# EAGLE design CAN_node (EAGLE 6.2)
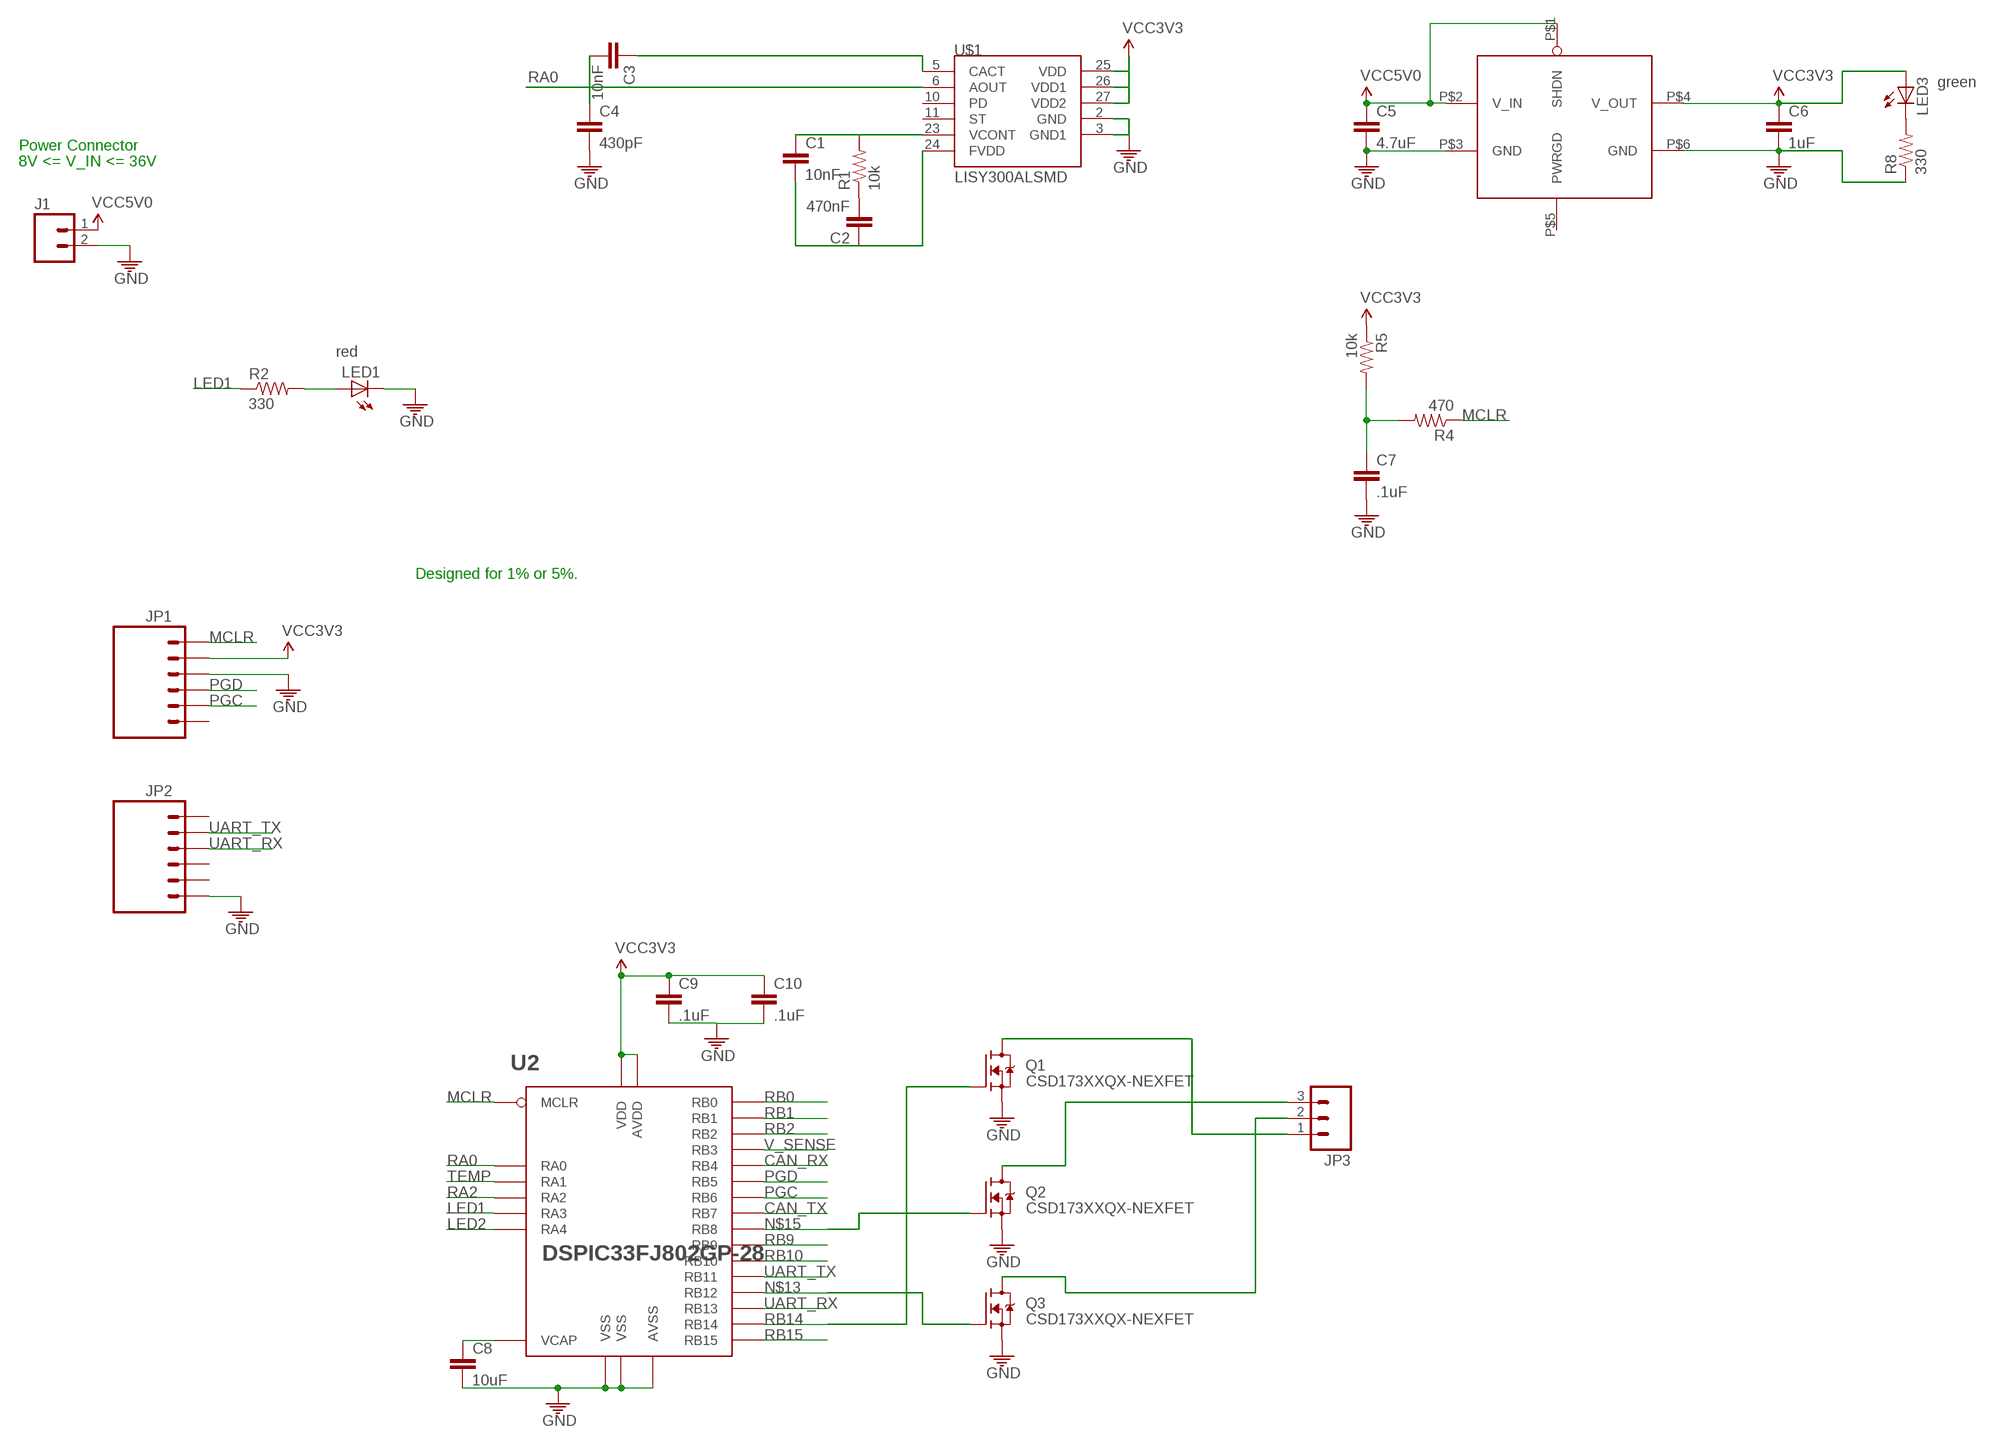
[diagram p0: schematic, sheet 1]

## Parts
C1  10nF  CAP1206  [1206]
C2  470nF  CAP1206  [1206]
C3  10nF  CAP1206  [1206]
C4  430pF  CAP1206  [1206]
C5  4.7uF  CAP1206  [1206]
C6  1uF  CAP1206  [1206]
C7  .1uF  CAP1206  [1206]
C8  10uF  CAP1206  [1206]
C9  .1uF  CAP1206  [1206]
C10  .1uF  CAP1206  [1206]
J1  M02PTH  [1X02]
JP1  M06LOCK  [1X06_LOCK]
JP2  M06LOCK  [1X06_LOCK]
JP3  M03PTH  [1X03]
LED1  LED1206  [LED-1206]
LED3  LED1206  [LED-1206]
Q1  CSD173XXQX-NEXFET  [CSD173XXQX]
Q2  CSD173XXQX-NEXFET  [CSD173XXQX]
Q3  CSD173XXQX-NEXFET  [CSD173XXQX]
R1  10k  RESISTOR0805-RES  [0805]
R2  330  RESISTOR0805-RES  [0805]
R4  470  RESISTOR0805-RES  [0805]
R5  10k  RESISTOR0805-RES  [0805]
R8  330  RESISTOR0805-RES  [0805]
U2  DSPIC33FJ802GP-28  [SOIC28-W]
U3  MCP1826  [SOT223-5]
U$1  LISY300ALSMD  [LGA28]

## Nets
CAN_RX: U2.P$11(RB4)
CAN_TX: U2.P$16(RB7)
GND [power]: C4.2 C5.2 C6.2 C7.2 C8.2 C9.2 C10.2 J1.2 JP1.3 JP2.6 LED1.C Q1.S1(S) Q1.S2(S) Q1.S3(S) Q2.S1(S) Q2.S2(S) Q2.S3(S) Q3.S1(S) Q3.S2(S) Q3.S3(S) R8.1 U2.P$8(VSS) U2.P$19(VSS) U2.P$27(AVSS) U3.P$3(GND) U3.P$6(GND) U$1.2(GND) U$1.3(GND1)
LED1: R2.1 U2.P$10(RA3)
LED2: U2.P$12(RA4)
MCLR: JP1.1 R4.1 U2.P$1(MCLR)
N$1: LED1.A R2.2
N$2: C2.2 R1.1
N$3: JP3.2 Q3.D
N$4: JP3.1 Q1.D
N$5: C1.1 R1.2 U$1.23(VCONT)
N$6: C7.1 R4.2 R5.2
N$7: C8.1 U2.P$20(VCAP)
N$8: LED3.C R8.2
N$9: JP3.3 Q2.D
N$10: C1.2 C2.1 U$1.24(FVDD)
N$12: C3.1 U$1.5(CACT)
N$13: Q3.G U2.P$23(RB12)
N$15: Q2.G U2.P$17(RB8)
PGC: JP1.5 U2.P$15(RB6)
PGD [small]: JP1.4 U2.P$14(RB5)
RA0: C3.2 C4.1 U2.P$2(RA0) U$1.6(AOUT)
RA2 [small]: U2.P$9(RA2)
RB0 [small]: U2.P$4(RB0)
RB1: U2.P$5(RB1)
RB2 [small]: U2.P$6(RB2)
RB9: U2.P$18(RB9)
RB10 [small]: U2.P$22(RB10)
RB14 [small]: Q1.G U2.P$25(RB14)
RB15 [small]: U2.P$26(RB15)
TEMP: U2.P$3(RA1)
UART_RX: JP2.3 U2.P$24(RB13)
UART_TX: JP2.2 U2.P$21(RB11)
V_SENSE: U2.P$7(RB3)
VCC3V3 [power]: C6.1 C9.1 C10.1 JP1.2 LED3.A R5.1 U2.P$13(VDD) U2.P$28(AVDD) U3.P$4(V_OUT) U$1.25(VDD) U$1.26(VDD1) U$1.27(VDD2)
VCC5V0 [power]: C5.1 J1.1 U3.P$1(SHDN) U3.P$2(V_IN)
Unconnected: JP1.6 JP2.1 JP2.4 JP2.5 U3.P$5(PWRGD) U$1.10(PD) U$1.11(ST)

## Notes on the sheet
- Power Connector
- 8V <= V_IN <= 36V
- Designed for 1% or 5%.

## Library data of the parts
C1-C4 = ASL:CAP: Capacitor Standard 0603 ceramic capacitor, and 0.1" leaded capacitor.
C5-C10 = CMPE118lib:CAP: Capacitor Standard 0603 ceramic capacitor, and 0.1" leaded capacitor.
J1 = ASL:M02: Header 2 Standard 2-pin 0.1" header. Use with straight break away headers (SKU : PRT-00116), right angle break away headers (PRT-00553), swiss pins (PRT-00743), machine pins (PRT-00117), and female headers (PRT-00115). Molex polarized connector foot print use with SKU : PRT-08233 with associated crimp pins and housings.
JP1 JP2 = CMPE118lib:M06: Header 6 Standard 6-pin 0.1" header. Use with straight break away headers (SKU : PRT-00116), right angle break away headers (PRT-00553), swiss pins (PRT-00743), machine pins (PRT-00117), and female headers (PRT-00115). Molex polarized connector foot print use with SKU : PRT-08094 with associated crimp pins and housings. NOTES ON THE VARIANTS LOCK and LOCK_LONGPADS... This footprint was designed to help hold the alignment of a through-hole component (i.e. 6-pin header) while soldering it into place. You may notice that each hole has been shifted either up or down by 0.005 of an inch from it's more standard position (which is a perfectly straight line). This slight alteration caused the pins (the squares in the middle) to touch the edges of the holes. Because they are alternating, it causes a "brace" to hold the component in place. 0.005 has proven to be the perfect amount of "off-center" position when using our standard breakaway headers. Although looks a little odd when you look at the bare footprint, once you have a header in there, the alteration is very hard to notice. Also, if you push a header all the way into place, it is covered up entirely on the bottom side. This idea of altering the position of holes to aid alignment will be further integrated into the Sparkfun Library for other footprints. It can help hold any component with 3 or more connection pins.
JP3 = ASL:M03: Header 3 Standard 3-pin 0.1" header. Use with straight break away headers (SKU : PRT-00116), right angle break away headers (PRT-00553), swiss pins (PRT-00743), machine pins (PRT-00117), and female headers (PRT-00115). Molex polarized connector foot print use with SKU : PRT-08232 with associated crimp pins and housings.
LED1 = CMPE118lib:LED: LEDs Standard schematic elements and footprints for 5mm, 3mm, 1206, and 0603 sized LEDs. 5mm - Spark Fun Electronics SKU : COM-00529 (and others); COLOR: red
LED3 = CMPE118lib:LED: LEDs Standard schematic elements and footprints for 5mm, 3mm, 1206, and 0603 sized LEDs. 5mm - Spark Fun Electronics SKU : COM-00529 (and others); COLOR: green
Q1-Q3 = bqevm_additional_ti_ics:CSD173XXQX: According to: http://www.ti.com/lit/ds/symlink/csd17308q3.pdf
R1 = ASL:RESISTOR: Resistor Basic schematic elements and footprints for 0603, 1206, and PTH resistors.
R2 R4 R5 R8 = CMPE118lib:RESISTOR: Resistor Basic schematic elements and footprints for 0603, 1206, and PTH resistors.
U2 = CMPE118lib:DSPIC33FJ*802GP-28: dspic33fj*802gp 28pin
U3 = CMPE118lib:MCP1826
U$1 = SparkFun-Sensors:LISY300AL: Single-axis 300 deg/s analog gyroscope. Untested part.

## Net classes
0 default: width 0.406 mm
1 power: width 0.762 mm, clearance 0.254 mm to class 0, clearance 0.508 mm
2 small: width 0.254 mm, clearance 0.254 mm to class 1

## Board
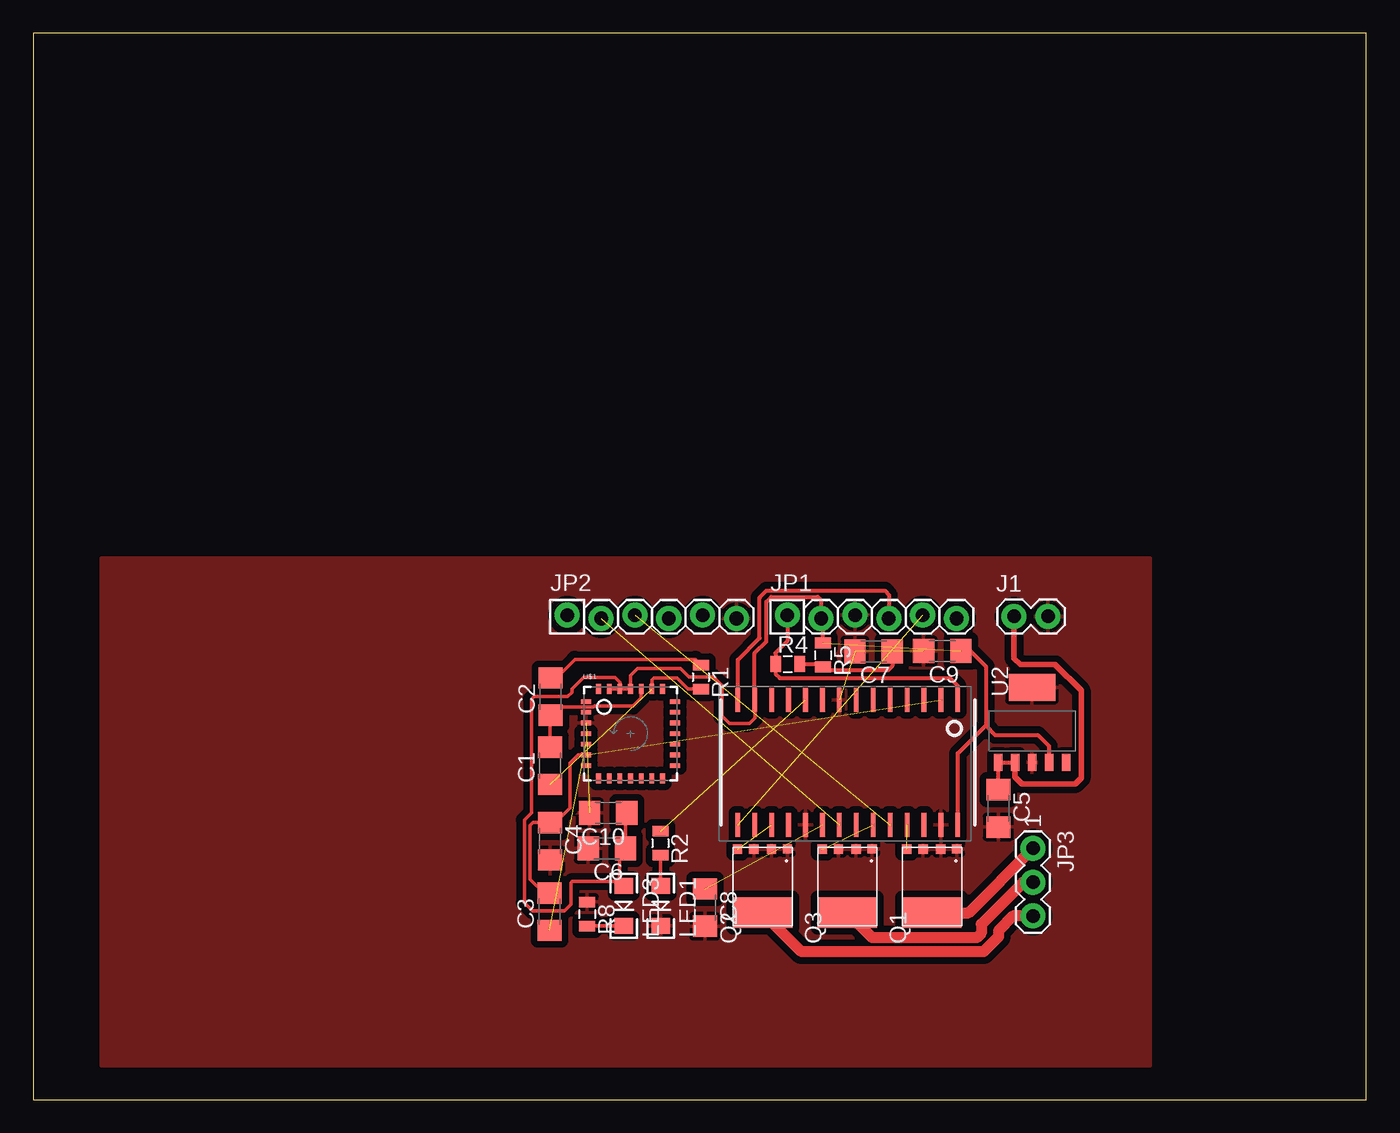
[diagram p1: board, top side]

Size 100 x 80 mm. Coordinates in mm from the lower left corner, seen from the top.
Outline: 0,0 100,0 100,80 0,80 0,0
Copper layers (1*16): Top 0.035mm / dielectric 1.5mm / Bottom 0.035mm
Design rules: minimum track width 10mil, minimum drill 24mil, track to track 8mil, track to pad 8mil, pad to pad 8mil, via to via 8mil, smd to smd 8mil, copper to edge 40mil, drill to drill 8mil, minimum pad ring 10mil, minimum via ring 8mil, stop-mask expansion 4mil, vias tented up to drill 0mil, thermal gap 10mil

### Footprints (pad centres in the part's own frame; a part is rotated, then mirrored left to right if it is on the bottom)
1206 = smd 1.6 x 1.8: 1 -1.4,0; 2 1.4,0
1X02 = drill 1.016 pad 1.88: 1 0,0; 2 2.54,0
1X06_LOCK = drill 1.016 pad 1.88: 1 0,0.127; 2 2.54,-0.127; 3 5.08,0.127; 4 7.62,-0.127; 5 10.16,0.127; 6 12.7,-0.127
1X03 = drill 1.016 pad 1.88: 1 -2.54,0; 2 0,0; 3 2.54,0
LED-1206 = smd 1.2 x 1.4: A -1.5,0; C 1.5,0
CSD173XXQX = smd 2.31 x 4.46: D 0,0 | smd 0.7 x 0.7: G 4.755,1.875; S1 4.755,0.65; S2 4.755,-0.675; S3 4.78,-1.875
0805 = smd 0.8 x 1.2: 1 -0.9,0; 2 0.9,0
SOIC28-W = smd 1.8 x 0.35: P$1 -4.6,8.4; P$2 -4.6,7.13; P$3 -4.6,5.86; P$4 -4.6,4.59; P$5 -4.6,3.32; P$6 -4.6,2.05; P$7 -4.6,0.78; P$8 -4.6,-0.49; P$9 -4.6,-1.76; P$10 -4.6,-3.03; P$11 -4.6,-4.3; P$12 -4.6,-5.57; P$13 -4.6,-6.84; P$14 -4.6,-8.11; P$15 4.8,-8.11; P$16 4.8,-6.84; P$17 4.8,-5.57; P$18 4.8,-4.3; P$19 4.8,-3.03; P$20 4.8,-1.76; P$21 4.8,-0.49; P$22 4.8,0.78; P$23 4.8,2.05; P$24 4.8,3.32; P$25 4.8,4.59; P$26 4.8,5.86; P$27 4.8,7.13; P$28 4.8,8.4
SOT223-5 = smd 0.635 x 1.27: P$1 -2.54,-2.625; P$2 -1.27,-2.625; P$3 0,-2.625; P$4 1.27,-2.625; P$5 2.54,-2.625 | smd 3.5 x 2: P$6 0,3
LGA28 = smd 0.75 x 0.35: 1 -3.35,2.4; 2 -3.35,1.6; 3 -3.35,0.8; 4 -3.35,0; 5 -3.35,-0.8; 6 -3.35,-1.6; 7 -3.35,-2.4; 15 3.35,-2.4; 16 3.35,-1.6; 17 3.35,-0.8; 18 3.35,0; 19 3.35,0.8; 20 3.35,1.6; 21 3.35,2.4 | smd 0.35 x 0.75: 8 -2.4,-3.35; 9 -1.6,-3.35; 10 -0.8,-3.35; 11 0,-3.35; 12 0.8,-3.35; 13 1.6,-3.35; 14 2.4,-3.35; 22 2.4,3.35; 23 1.6,3.35; 24 0.8,3.35; 25 0,3.35; 26 -0.8,3.35; 27 -1.6,3.35; 28 -2.4,3.35

### Placement (x,y rotation side)
C1  38.79,25.04 90 top
C2  38.81,30.23 90 top
C3  38.73,14.1 90 top
C4  38.76,19.38 270 top
C5  72.39,21.84 270 top
C6  43.03,18.85 180 top
C7  63.04,33.63 180 top
C8  50.39,14.4 270 top
C9  68.2,33.66 180 top
C10  43.13,21.49 180 top
J1  73.58,36.25 0 top
JP1  56.57,36.22 0 top
JP2  40.06,36.22 0 top
JP3  75.01,16.31 270 top
LED1  47.07,14.53 270 top
LED3  44.3,14.53 270 top
Q1  67.41,14.02 90 top
Q2  54.71,14.02 90 top
Q3  61.06,14.02 90 top
R1  50.09,31.7 270 top
R2  47.04,19.23 270 top
R4  56.59,32.66 0 top
R5  59.26,33.35 270 top
R8  41.55,13.92 270 top
U2  60.96,25.4 270 top
U3  74.93,27.91 0 top
U$1  44.81,27.46 0 top

### Tracks (layer width: path | path; a pad name or v marks a point on that pad's centre or on a via)
GND  (3 unrouted)
  pour Top: 5.08,40.64 83.82,40.64 83.82,38.1 83.82,2.54 5.08,2.54 5.08,7.62
LED1  (1 unrouted)
MCLR
  Top 0.305: JP1.1 56.57,34.39 55.68,33.5 55.68,32.68 R4.1 55.69,31.94 56.01,31.62 68.78,31.62 69.34,31.06 69.34,30.02 U2.P$1
N$1
  Top 0.254: R2.2 47.04,16.05 LED1.A
N$2
  Top 0.254: C2.2 39.25,31.63 40.64,33.02 49.67,33.02 R1.1
N$3
  Top 0.813: JP3.2 74.27,16.31 71.12,13.16 71.12,12.47 70.79,12.14 62.94,12.14 Q3.D
N$4
  Top 0.813: Q1.D 70.18,14.02 JP3.1
N$5  (1 unrouted)
  Top 0.254: R1.2 49.13,30.8 48.28,31.65 46.56,31.65 46.41,31.5 U$1.23
N$6
  Top 0.305: R4.2 59.04,32.66 R5.2 59.5,32.21 64.14,32.21 64.44,32.52 C7.1
N$7  (1 unrouted)
N$8
  Top 0.254: LED3.C 41.56,13.03 R8.2
N$9
  Top 0.813: JP3.3 73.51,13.77 72.42,12.68 72.42,12.22 71.3,11.1 57.63,11.1 Q2.D
N$10
  Top 0.254: C1.2 38.79,28.8 C2.1 39.45,29.46 42.04,29.46 42.09,29.52 44.98,29.52 45.61,30.14 U$1.24
N$12  (1 unrouted)
N$13  (1 unrouted)
N$15  (1 unrouted)
PGC  (1 unrouted)
PGD
  Top 0.305: U2.P$14 52.85,32.99 54.48,34.62 54.48,37.67 54.99,38.18 63.88,38.18 64.21,37.85 64.21,36.12 JP1.4
RA0  (1 unrouted)
  Top 0.254: C3.2 38.33,15.5 37.29,16.54 37.29,20.57 37.49,20.78 C4.1 39.17,20.78 40.26,21.87 40.26,25.25 40.87,25.86 U$1.6
RB14  (1 unrouted)
UART_RX  (1 unrouted)
UART_TX  (1 unrouted)
VCC3V3  (1 unrouted)
  Top 0.254: U$1.26 U$1.25 44.81,31.8 45.34,32.33 48.56,32.33 49.2,31.7 51.03,31.7 51.66,31.06 51.66,28.78 52.22,28.22 53.72,28.22 54.13,28.63 U2.P$13 | U$1.26 U$1.27 | U$1.26 44.01,31.3 43.64,31.67 41.27,31.67 40.41,30.81 40.41,30.56 40.08,30.23 37.57,30.23 37.36,30.02 37.36,21.49 36.85,20.98 36.85,14.76 37.44,14.17 39.85,14.17 40.34,14.66 40.34,16.26 40.44,16.36 43.97,16.36 | 43.97,16.36 LED3.A | 43.97,16.36 43.97,18.39 C6.1 44.43,21.39 C10.1
  Top 0.305: U2.P$13 54.12,33.49 54.99,34.37 54.99,37.34 55.37,37.72 58.85,37.72 59.11,37.47 JP1.2 59.26,35.94 R5.1 | C9.1 70.31,33.66 71.45,32.51 71.45,28.07 | 71.45,28.07 72.16,27.36 75.36,27.36 76.2,26.52 U3.P$4 | U2.P$28 69.36,25.98 71.45,28.07
VCC5V0
  Top 0.305: C5.1 U3.P$1 U3.P$2
  Top 0.406: J1.1 73.58,33.1 74.04,32.64 76.66,32.64 78.61,30.68 78.61,24.13 78.18,23.7 74.17,23.7 73.66,24.21 U3.P$2